# Altium schematic sheet Cpu.SchDoc
size A4; SheetNumber: 3; SheetTotal: 4
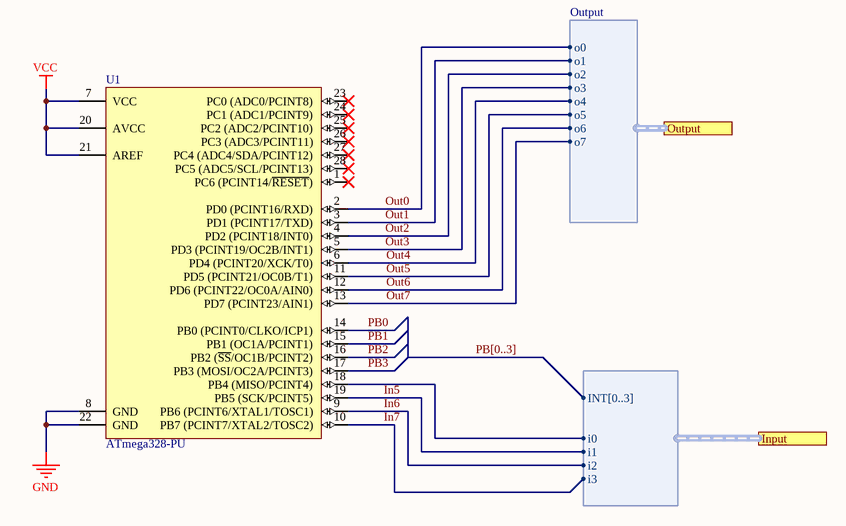
[diagram p0: Cpu.SchDoc]

## Parts
U1  ATmega328-PU  [28P3]

## Ports
Input (harness Input), Output (harness Output)

## Harnesses
Input: INT[0..3], i0, i1, i2, i3
Output: o0, o1, o2, o3, o4, o5, o6, o7

## Nets
GND: U1.8(GND) U1.22(GND)
VCC: U1.7(VCC) U1.20(AVCC) U1.21(AREF)
In5: U1.19(PB5_(SCK/PCINT5)) ; port Input.i1
In6: U1.9(PB6_(PCINT6/XTAL1/TOSC1)) ; port Input.i2
In7: U1.10(PB7_(PCINT7/XTAL2/TOSC2)) ; port Input.i3
Out0: U1.2(PD0_(PCINT16/RXD)) ; port Output.o0
Out1: U1.3(PD1_(PCINT17/TXD)) ; port Output.o1
Out2: U1.4(PD2_(PCINT18/INT0)) ; port Output.o2
Out3: U1.5(PD3_(PCINT19/OC2B/INT1)) ; port Output.o3
Out4: U1.6(PD4_(PCINT20/XCK/T0)) ; port Output.o4
Out5: U1.11(PD5_(PCINT21/OC0B/T1)) ; port Output.o5
Out6: U1.12(PD6_(PCINT22/OC0A/AIN0)) ; port Output.o6
Out7: U1.13(PD7_(PCINT23/AIN1)) ; port Output.o7
PB0: U1.14(PB0_(PCINT0/CLKO/ICP1))
PB1: U1.15(PB1_(OC1A/PCINT1))
PB2: U1.16(PB2_(~{SS}/OC1B/PCINT2))
PB3: U1.17(PB3_(MOSI/OC2A/PCINT3))
NetU1_18: U1.18(PB4_(MISO/PCINT4)) ; port Input.i0

Not connected (* = marked no-connect by the designer): U1 1(PC6_(PCINT14/~{RESET}))* 23(PC0_(ADC0/PCINT8))* 24(PC1_(ADC1/PCINT9))* 25(PC2_(ADC2/PCINT10))* 26(PC3_(ADC3/PCINT11))* 27(PC4_(ADC4/SDA/PCINT12))* 28(PC5_(ADC5/SCL/PCINT13))*

## Buses and harness runs
bus PB[0..3]

## Library data of the parts
U1 = CMP-0095-00015-2: 8-bit AVR Microcontroller, 32KB Flash, 1KB EEPROM, 2KB SRAM, 28-pin PDIP, Industrial Grade (-40°C to 85°C); ComponentLink3Description: ATmega48A/48PA/88A/88PA/168A/168PA/328/328P Summary; RevisionNote: DatasheetVersion updated. URLs added.; DatasheetVersion: revD, May-2011; ComponentLink1URL: http://www.atmel.com/; PackageVersion: revB, Sep-2001; PackageDescription: 28-lead (0.300"/7.62mm Wide) Plastic Dual Inline Package (PDIP); PackageReference: 28P3; ComponentLink1Description: Manufacturer URL; ComponentLink2Description: ATmega48A/48PA/88A/88PA/168A/168PA/328/328P Datasheet; ComponentLink3URL: http://www.atmel.com/dyn/resources/prod_documents/8271S.pdf; ComponentLink2URL: http://www.atmel.com/dyn/resources/prod_documents/8271.pdf